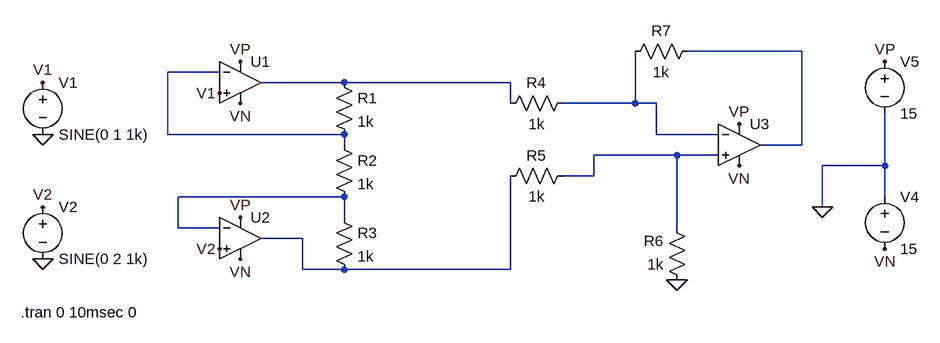
[diagram p0: schematic exp_2_electro.asc]
exp_2_electro.asc, the LTspice schematic file:
Version 4
SHEET 1 1480 680
WIRE 1056 80 880 80
WIRE 160 112 80 112
WIRE 352 128 224 128
WIRE 608 128 352 128
WIRE 608 160 608 128
WIRE 800 160 800 80
WIRE 800 160 688 160
WIRE 832 160 800 160
WIRE 80 208 80 112
WIRE 352 208 80 208
WIRE 832 208 832 160
WIRE 928 208 832 208
WIRE 352 224 352 208
WIRE 1056 224 1056 80
WIRE 1056 224 992 224
WIRE 864 240 736 240
WIRE 928 240 864 240
WIRE 1184 256 1184 176
WIRE 1184 256 1088 256
WIRE 736 272 736 240
WIRE 736 272 688 272
WIRE 352 304 96 304
WIRE 1184 304 1184 256
WIRE 1088 320 1088 256
WIRE 352 336 352 304
WIRE 96 352 96 304
WIRE 160 352 96 352
WIRE 864 352 864 240
WIRE 288 368 224 368
WIRE 288 416 288 368
WIRE 352 416 288 416
WIRE 608 416 608 272
WIRE 608 416 352 416
FLAG 864 432 0
FLAG 1088 320 0
FLAG -112 400 0
FLAG -112 208 0
FLAG 192 96 VP
FLAG 192 336 VP
FLAG 960 192 VP
FLAG 1184 96 VP
FLAG 1184 384 VN
FLAG 960 256 VN
FLAG 192 160 VN
FLAG 192 400 VN
FLAG 160 144 V1
FLAG -112 128 V1
FLAG -112 320 V2
FLAG 160 384 V2
SYMBOL OpAmps\\UniversalOpAmp 192 128 R0
SYMATTR InstName U1
SYMBOL OpAmps\\UniversalOpAmp 192 368 R0
SYMATTR InstName U2
SYMBOL OpAmps\\UniversalOpAmp 960 224 R0
SYMATTR InstName U3
SYMBOL res 336 112 R0
SYMATTR InstName R1
SYMATTR Value 1k
SYMBOL res 336 208 R0
SYMATTR InstName R2
SYMATTR Value 1k
SYMBOL res 336 320 R0
SYMATTR InstName R3
SYMATTR Value 1k
SYMBOL res 704 144 R90
WINDOW 0 0 56 VBottom 2
WINDOW 3 32 56 VTop 2
SYMATTR InstName R4
SYMATTR Value 1k
SYMBOL res 704 256 R90
WINDOW 0 0 56 VBottom 2
WINDOW 3 32 56 VTop 2
SYMATTR InstName R5
SYMATTR Value 1k
SYMBOL res 880 448 R180
WINDOW 0 36 76 Left 2
WINDOW 3 36 40 Left 2
SYMATTR InstName R6
SYMATTR Value 1k
SYMBOL res 784 96 R270
WINDOW 0 32 56 VTop 2
WINDOW 3 0 56 VBottom 2
SYMATTR InstName R7
SYMATTR Value 1k
SYMBOL voltage -112 112 R0
WINDOW 123 0 0 Left 0
WINDOW 39 0 0 Left 0
SYMATTR InstName V1
SYMATTR Value SINE(0 1 1k)
SYMBOL voltage -112 304 R0
WINDOW 123 0 0 Left 0
WINDOW 39 0 0 Left 0
SYMATTR InstName V2
SYMATTR Value SINE(0 2 1k)
SYMBOL voltage 1184 288 R0
WINDOW 123 0 0 Left 0
WINDOW 39 0 0 Left 0
SYMATTR InstName V4
SYMATTR Value 15
SYMBOL voltage 1184 80 R0
WINDOW 123 0 0 Left 0
WINDOW 39 0 0 Left 0
SYMATTR InstName V5
SYMATTR Value 15
TEXT -146 482 Left 2 !.tran 0 10msec 0

The netlist it stands for:
* exp_2_electro.asc
XU1 V1 N002 VP VN N003 level1 Avol=1Meg GBW=10Meg Vos=0 En=0 Enk=0 In=0 Ink=0 Rin=500Meg  ; pins In+ In- V+ V- OUT
XU2 V2 N006 VP VN N007 level1 Avol=1Meg GBW=10Meg Vos=0 En=0 Enk=0 In=0 Ink=0 Rin=500Meg  ; pins In+ In- V+ V- OUT
XU3 N005 N004 VP VN N001 level1 Avol=1Meg GBW=10Meg Vos=0 En=0 Enk=0 In=0 Ink=0 Rin=500Meg  ; pins In+ In- V+ V- OUT
R1 N003 N002 1k
R2 N002 N006 1k
R3 N006 N007 1k
R4 N004 N003 1k
R5 N005 N007 1k
R6 0 N005 1k
R7 N004 N001 1k
V1 V1 0 SINE(0 1 1k)
V2 V2 0 SINE(0 2 1k)
V4 0 VN 15
V5 VP 0 15
.tran 0 10msec 0
.lib UniversalOpAmp1.lib
.backanno
.end